# Altium project FPGA Accoustics.PrjPcb
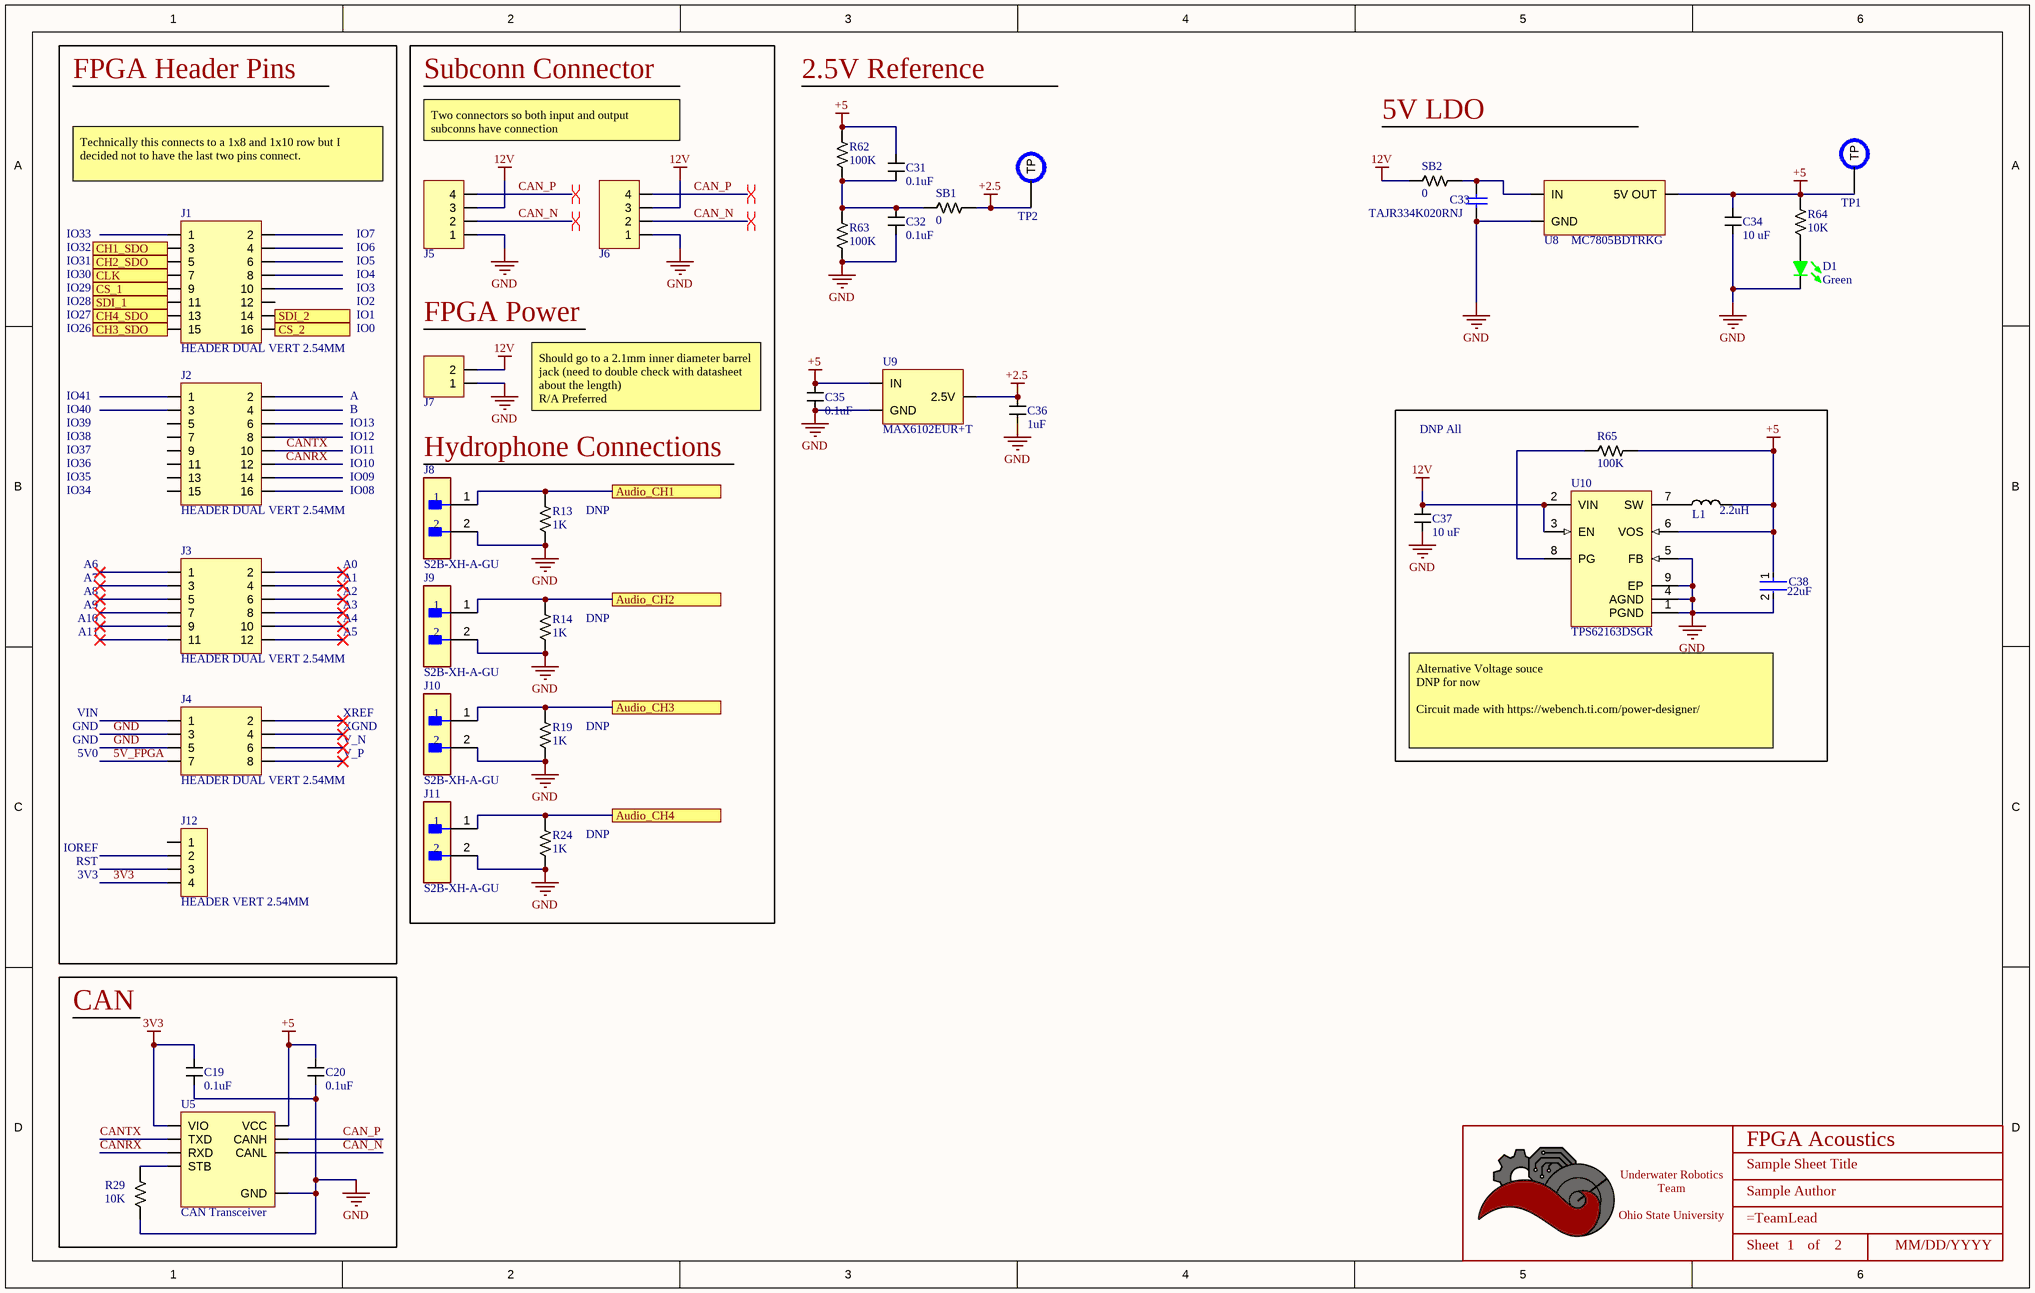
[diagram p0: Connectors.SchDoc]
ProjectTitle: FPGA Acoustics
2 sheets, 137 parts. Net scope: flat (ports and power ports of the same name join across sheets).
Board file: FPGA.PcbDoc
Sheets:
  Connectors.SchDoc
  Filters.SchDoc

## Sheet Connectors.SchDoc: Sample Sheet Title
size B; Date: MM/DD/YYYY; Author: Sample Author; Organization: ORGANIZATION; Address1: ADDRESS 1; Address2: ADDRESS 2; Address3: ADDRESS 3; Address4: ADDRESS 4; Revision: -; SheetNumber: 1; SheetTotal: 2; ENG_APP_DATE: --/--/--; DSN_APP_DATE: --/--/--; CHK_APP_DATE: --/--/--

### Parts
(Parts that share a designator on the sheet are numbered #1, #2 ... from top to bottom, then left to right.)
*#1  Title_Block  [LOGO]  (value not drawn)  (graphical)
C19  value 0.1uF  [CAPACITOR_0402]  (hidden comment: 100nF Ceramic 25V)
C20  value 0.1uF  [CAPACITOR_0402]  (hidden comment: 100nF Ceramic 25V)
C31  value 0.1uF  [CAPACITOR_0603]  (hidden comment: 100nF Ceramic 6.3V)
C32  value 0.1uF  [CAPACITOR_0603]  (hidden comment: 100nF Ceramic 6.3V)
C33  TAJR334K020RNJ  [CAPC2113X120X50NL20T30]
C34  Value (uF): 10 uF  [CAPACITOR_0603]  (hidden comment: 10uF Ceramic 6.3V)
C35  value 0.1uF  [CAPACITOR_0603]  (hidden comment: 100nF Ceramic 25V)
C36  value 1uF  [CAPACITOR_0603]  (hidden comment: 1uF Ceramic 16V)
C37  Value (uF): 10 uF  [CAPACITOR_1206]  (hidden comment: 10uF Ceramic 25V)
C38  Capacitance: 22uF  [FP-GRM31C-0_2-e0_3_0_8-MFG]  (hidden comment: GRM31CR71A226KE15L)
D1  Color: Green  [LED_0603]  (hidden comment: 150060GS75000)
J1  HEADER DUAL VERT 2.54MM  [HEADER_2x8PIN_2.54mm]
J2  HEADER DUAL VERT 2.54MM  [HEADER_2x8PIN_2.54mm]
J3  HEADER DUAL VERT 2.54MM  [HEADER_2x6PIN_2.54mm]
J4  HEADER DUAL VERT 2.54MM  [HEADER_2x4PIN_2.54mm]
J5  Microfit+ R/A  [CONN_MOLEX_MICROFIT+_4_POS_R/A - duplicate]  (value not drawn)
J6  Microfit+ R/A  [CONN_MOLEX_MICROFIT+_4_POS_R/A - duplicate]  (value not drawn)
J7  Microfit+ R/A  [CONN_MOLEX_MICROFIT+_2Flat_POS_R/A]  (value not drawn)
J8  S2B-XH-A-GU  [FP-S2B-XH-A-GU-MFG]
J9  S2B-XH-A-GU  [FP-S2B-XH-A-GU-MFG]
J10  S2B-XH-A-GU  [FP-S2B-XH-A-GU-MFG]
J11  S2B-XH-A-GU  [FP-S2B-XH-A-GU-MFG]
J12  HEADER VERT 2.54MM  [HEADER_4PIN_2.54MM]
L1  value 2.2uH  [PA4332.222NLT]  (hidden comment: 2.2uH Shielded)
R13  Value  (Ohms): 1K  [RESISTOR_0402]  (hidden comment: 1k Ohm 1% 1/16W)
R14  Value  (Ohms): 1K  [RESISTOR_0402]  (hidden comment: 1k Ohm 1% 1/16W)
R19  Value  (Ohms): 1K  [RESISTOR_0402]  (hidden comment: 1k Ohm 1% 1/16W)
R24  Value  (Ohms): 1K  [RESISTOR_0402]  (hidden comment: 1k Ohm 1% 1/16W)
R29  Value  (Ohms): 10K  [RESISTOR_0402]  (hidden comment: 10k Ohm 1% 1/16W)
R62  Value  (Ohms): 100K  [RESISTOR_0603]  (hidden comment: 100k Ohm 0.5% 1/10W)
R63  Value  (Ohms): 100K  [RESISTOR_0603]  (hidden comment: 100k Ohm 0.5% 1/10W)
R64  Value  (Ohms): 10K  [RESISTOR_0603]  (hidden comment: 10k Ohm 5% 1/10W)
R65  Value  (Ohms): 100K  [RESISTOR_0402]  (hidden comment: 100k Ohm 1% 1/16W)
SB1  Value  (Ohms): 0  [RESISTOR_0603]  (hidden comment: 0 Ohm Jumper No Fit)
SB2  value 0  [RESISTOR_1206]  (hidden comment: JUMPER_0_1206)
TP1  PCB Test Point  [TESTPOINT_1.2MM]  (value not drawn)  (no BOM)
TP2  PCB Test Point  [TESTPOINT_1.2MM]  (value not drawn)  (no BOM)
U5  CAN Transceiver  [SOIC-8]
U8  MC7805BDTRKG  [DPAK-2]
U9  MAX6102EUR+T  [SOT-23-3]
U10  TPS62163DSGR  [DSG0008A_V]

### Blocks framed on the sheet
FPGA Header Pins: J1-J4 J12
DNP All: C37 C38 L1 R65 U10
CAN: C19 C20 R29 U5

### Ports
Audio_CH1, Audio_CH2, Audio_CH3, Audio_CH4, CH1_SDO, CH2_SDO, CH3_SDO, CH4_SDO, CLK, CS_1, CS_2, SDI_1, SDI_2

### Nets
3V3: C19.1 J12.4 U5.5(VIO)
12V: C37.1 J5.3 J6.3 J7.2 SB2.2 U10.2(VIN) U10.3(EN)
+2.5: C36.1 SB1.1 TP2.TP U9.2(2.5V)
+5: C20.1 C31.1 C34.1 C35.1 C38.1 L1.1 R62.1 R64.1 R65.1 TP1.TP U5.3(VCC) U8.3(5V_OUT) U9.1(IN) U10.6(VOS)
GND: C19.2 C20.2 C32.2 C33.1 C34.2 C35.2 C36.2 C37.2 C38.2 D1.2 J4.3 J4.5 J5.1 J6.1 J7.1 J8.2 J9.2 J10.2 J11.2 R13.2 R14.2 R19.2 R24.2 R29.2 R63.2 U5.2(GND) U8.2(GND) U9.3(GND) U10.1(PGND) U10.4(AGND) U10.5(FB) U10.9(EP)
5V_FPGA: J4.7
Audio_CH1: J8.1 R13.1 ; port Audio_CH1
Audio_CH2: J9.1 R14.1 ; port Audio_CH2
Audio_CH3: J10.1 R19.1 ; port Audio_CH3
Audio_CH4: J11.1 R24.1 ; port Audio_CH4
CAN_N: J5.2 J6.2 U5.6(CANL)
CAN_P: J5.4 J6.4 U5.7(CANH)
CANRX: J2.12 U5.4(RXD)
CANTX: J2.10 U5.1(TXD)
CH1_SDO: J1.3 ; port CH1_SDO
CH2_SDO: J1.5 ; port CH2_SDO
CH3_SDO: J1.15 ; port CH3_SDO
CH4_SDO: J1.13 ; port CH4_SDO
CLK: J1.7 ; port CLK
CS_1: J1.9 ; port CS_1
CS_2: J1.16 ; port CS_2
SDI_1: J1.11 ; port SDI_1
SDI_2: J1.14 ; port SDI_2
NetC31_2: C31.2 C32.1 R62.2 R63.1 SB1.2
NetC33_2: C33.2 SB2.1 U8.1(IN)
NetD1_1: D1.1 R64.2
NetL1_2: L1.2 U10.7(SW)
NetR29_1: R29.1 U5.8(STB)
NetR65_2: R65.2 U10.8(PG)

Not connected (* = marked no-connect by the designer): J1 1 2 4 6 8 10 12; J2 1 2 3 4 5 6 7 8 9 11 13 14 15 16; J3 1* 2* 3* 4* 5* 6* 7* 8* 9* 10* 11* 12*; J4 1 2* 4* 6* 8*; J12 1 2 3

### Layout directives
differential pair: CAN_N, CAN_P

### Notes on the sheet
- Subconn Connector
- 2.5V Reference
- Two connectors so both input and output subconns have connection
- 5V LDO
- IO33
- Technically this connects to a 1x8 and 1x10 row but I decided not to have the last two pins connect.
- IO7
- IO29
- IO30
- IO31
- IO32
- IO6
- IO5
- IO4
- IO3
- IO26
- IO27
- IO28
- IO2
- IO1
- IO0
- FPGA Power
- IO41
- IO40
- IO39
- A
- B
- IO13
- Should go to a 2.1mm inner diameter barrel jack (need to double check with datasheet about the length)
  R/A Preferred
- IO38
- IO37
- IO36
- IO35
- IO34
- IO12
- IO11
- IO10
- IO09
- IO08
- Hydrophone Connections
- A6
- A0
- (near R13) DNP
- A7
- A8
- A9
- A10
- A11
- A1
- A2
- A3
- A4
- A5
- (near R14) DNP
- VIN
- GND
- 5V0
- XREF
- XGND
- V_N
- V_P
- (near R19) DNP
- Alternative Voltage souce
  DNP for now
  Circuit made with https://webench.ti.com/power-designer/
- (near R24) DNP
- IOREF
- RST
- 3V3
- DWG. NO.
- REV.
- SHT.
- THIS DOCUMENT AND THE DATA DISCLOSED HEREIN OR HEREWITH IS THE PROPERTY OF ALTIUM LIMITED AND MAY BE FREELY DISTRIBUTED IN WHOLE. NO RIGHTS ARE RESERVED OR EXPRESS OR IMPLIED WARANTEE GIVEN.
- REVISION
- DESCRIPTION
- DATE
- APPROVED
- ENG:
- APPROVALS
- PROJECT
- DSN:
- CHK:
- REFERENCE DOCUMENTS
- PROJECT REVISION:
- TITLE
- DOCUMENT REVISION:
- DESIGN ITEM:
- BOM:
- FAB DWG:
- PCB DWG:
- ASSY DWG:
- SCALE:
- SIZE
- CAGE CODE
- FILE NAME
- DWG NO.
- SHEET
- OF
- REV
- (in symbol Title_Block) Underwater Robotics Team / Ohio State University; Sheet; of

### Library data of the parts
*#1 = Title_Block: UWRT Schematic Title Block Template / Created June 2021, Dylan Trainor
C19 C20 = CAPACITOR_0.1uF_0402: Cap 100nF 25V +/-10% / Ceramic 0402; Made By: Robert Pafford; Tolerance: +/- 10%; Voltage: 25V; Supplier 1: Digi-Key; Supplier Part Number 1: 478-7868-1-ND
C31 C32 = CAPACITOR_0.1uF_0603: Cap 100nF 6.3V +/-10% / Ceramic 0603; Made By: Flip B; ComponentLink1Description: Datsheet; ComponentLink1URL: https://www.mouser.com/datasheet/2/212/KEM_C1002_X7R_SMD-1102033.pdf; Tolerance: +/- 10%; Voltage: 6.3V; Supplier 1: Digi-Key; Supplier Part Number 1: 399-15351-1-ND
C33 = CMP-2007-04068-1: Manufacturer: AVX Interconnect / Elco; Part Number: TAJR334K020RNJ
C34 = CAPACITOR_10uF_0603: Cap 10uF 6.3V +/-20% / Ceramic 0603; Made By: Flip B; ComponentLink1Description: Digikey; ComponentLink1URL: https://www.digikey.com/en/products/detail/samsung-electro-mechanics/CL10A106MQ8NNNC/3886777; Supplier 1: Digi-Key; Supplier Part Number 1: 1276-1119-1-ND; Tolerance: +/- 20%; Voltage: 6.3V
C35 = CAPACITOR_0.1uF_0603_25V: Cap 100nF 25V +/-10% / Ceramic 0603; Voltage: 6.3V; Made By: Flip B; ComponentLink1Description: Datsheet; ComponentLink1URL: https://www.mouser.com/datasheet/2/212/KEM_C1002_X7R_SMD-1102033.pdf; Tolerance: +/- 10%; Supplier 1: Digikey; Supplier Part Number 1: 1276-1006-1-ND
C36 = CAPACITOR_1uF_0603: Cap 1uF 16V +/-10% / Ceramic 0603; Made By: Flip B; Tolerance: +/- 10%; Voltage: 16V; Supplier 1: Arrow Electronics; Supplier Part Number 1: C1608X7R1C105K080AC
C37 = CAPACITOR_10uF_1206: Cap 10uF 25V +/-10% / Ceramic 1206; Made By: Robert Pafford; Tolerance: +/- 10%; Voltage: 25V; Supplier 1: Digi-Key; Supplier Part Number 1: 1276-1804-6-ND
C38 = CMP-06035-003841-1: Chip Multilayer Ceramic Capacitors for General Purpose, 1206, 22uF, X7R, 15%, 10%, 10V; Height: 1.6mm; Width: 0.063inch; Min Operating Temperature: -55°C; Package Quantity: 1; Termination: SMD/SMT; Length: 3.2mm; Voltage Rating: 10V; Case/Package: 1206; Case Code (Imperial): 1206; Depth: 1.6mm; Dielectric: X7R; Voltage: 10V; Material: Ceramic; Tolerance: 10%; Voltage Rating (DC): 10V; Lead Free: Lead Free; Max Operating Temperature: 125°C; Case Code (Metric): 3216; Packaging: Tape and Reel; Thickness: 0.071inch; Radiation Hardening: No; REACH SVHC: No SVHC; Mount: Surface Mount
D1 = LED_Green_0603_3.2V: LED Green Vf= 3.2V If = 0.025A / 150060GS75000; Made By: Flip B; Forward Current: 25mA; Supplier 1: Digi-Key; ComponentLink1Description: Datasheet; ComponentLink1URL: https://www.we-online.de/katalog/datasheet/150060GS75000.pdf; Supplier Part Number 1: 732-4971-1-ND; Forward Voltage: 3.2V; Package: 0603
J1 J2 = HEADER_2x8PIN_2.54_1: CONN HEADER VERT 8POS 2.54MM; Pitch (mm): 2.54; Positions: 16; Created By: John Ulm; Supplier 1: DigiKey; Supplier Part Number 1: WM8144-ND
J3 = HEADER_2x6PIN_2.54: CONN HEADER VERT 6POS 2.54MM; Pitch (mm): 2.54; Positions: 12; Created By: John Ulm; Supplier 1: DigiKey; Supplier Part Number 1: 2057-PH2-12-UA-ND
J4 = HEADER_2x4PIN_2.54_1: CONN HEADER VERT 4POS 2.54MM; Pitch (mm): 2.54; Positions: 8; Created By: John Ulm; Supplier 1: RS (Formerly Allied Electronics); Supplier Part Number 1: PH2-08-UA
J5 J6 = CONN_MOLEX_MICROFIT+_4POS_R/A: Molex Microfit+ / 212528 4 POS R/A Black; Pitch: 3.0mm; Current Per Pin: 12.5A; Manufacturer: Molex; Supplier 1: Digikey; Supplier Part Number 1: 900-2125280400-ND; Configuration: R/A; Color: Black
J7 = CONN_MOLEX_MICROFIT+_2POS_Flat_R/A: Molex Microfit+ / 2157601002 2POS Right Angle; Pitch: 3.0mm; Current Per Pin: 12.5A; Manufacturer: Molex; Configuration: R/A; Color: Black; Supplier 1: DigiKey; Supplier Part Number 1: 900-2157601002-ND
J8-J11 = CMP-17439-000226-1: Conn Shrouded Header HDR 2 POS 2.45mm Solder ST Top Entry Thru-Hole; Lead Free: Lead Free
J12 = HEADER_4PIN_2.54MM: CONN HEADER VERT 4POS 2.54MM; Made By: Robert Pafford; Supplier 1: Digi-Key; Supplier Part Number 1: S1012E-04-ND
L1 = INDUCTOR_2.2uH: 2.2 µH Shielded Drum Core, Wirewound Inductor 4.3 A 48mOhm Max Nonstandard; Supplier 1: DigiKey; Supplier Part Number 1: 553-3290-1-ND
R13 R14 R19 R24 = RESISTOR_1K_0402: RES 1k OHM 1% 1/16W 0402; Tolerance: +/- 1%; Made By: Robert Pafford; Wattage: 1/16W; Supplier: Digikey; Digikey Part Numer: CR0603-JW-104ELFTR-ND; Supplier 1: Digi-Key; Supplier Part Number 1: 13-AC0402FR-131KLCT-ND
R29 = RESISTOR_10K_0402: RES 10k OHM 1% 1/16W 0402; Tolerance: +/- 1%; Made By: Robert Pafford; Wattage: 1/16W; Supplier: Digikey; Digikey Part Numer: CR0603-JW-104ELFTR-ND; Supplier 1: Digi-Key; Supplier Part Number 1: YAG3436CT-ND
R62 R63 = RESISTOR_100K_0.5%_0603: RES 100k OHM 0.5% 1/10W 0603; Tolerance: +/- 0.5%; Made By: John Ulm; ComponentLink1Description: Datasheet; ComponentLink1URL: https://www.bourns.com/docs/product-datasheets/CRxxxxx.pdf; Wattage: 1/10W; Supplier: Digikey; Digikey Part Numer: CR0603-JW-104ELFTR-ND; Supplier 1: Digi-Key; Supplier Part Number 1: 311-2395-1-ND
R64 = RESISTOR_10K_0603: RES 10k OHM 5% 1/10W 0603; Tolerance: +/- 5%; Wattage: 1/8W; Made By: Robert Pafford; ComponentLink1Description: Datasheet; ComponentLink1URL: https://www.bourns.com/docs/product-datasheets/CRxxxxx.pdf; Supplier: Digikey; Digikey Part Numer: CR0603-JW-104ELFTR-ND; Supplier 1: Digi-Key; Supplier Part Number 1: 2019-RK73B1JTTD103JCT-ND
R65 = RESISTOR_100K_0402: RES 100k OHM 1% 1/16W 0402; Tolerance: +/- 1%; Made By: Robert Pafford; Wattage: 1/16W; Supplier 1: Digikey; Supplier Part Number 1: YAG3434CT-ND
SB1 = JUMPER_0_0603: 0 Ohm Jumper No Fit for Solder Bridge; Made By: Robert Pafford; ComponentLink1Description: Digikey; ComponentLink1URL: https://www.digikey.com/en/products/detail/koa-speer-electronics-inc/RK73B1JTTD101J/9844701
SB2 = JUMPER_0_1206: JUMPER 0OHM 1206
TP1 TP2 = TESTPOINT: Made By: Robert Pafford
U5 = TJA1442AT: CAN Interface IC High-Speed CAN Transceiver with Standby Mode; Made By: Robert Pafford; Max Data Rate: 5Mbps; Supplier 1: Mouser; Supplier Part Number 1: 771-TJA1442AT/0Z
U8 = MC7805BDTRKG: Linear Voltage Regulator IC Positive Fixed 1 Output 1A DPAK
U9 = MAX6102EUR+T: Series Voltage Reference IC Fixed 2.5V V ±0.4% 5 mA SOT-23-3; Supplier 1: DigiKey; Supplier Part Number 1: MAX6102EUR+TCT-ND
U10 = CMP-0323-00318-3: Buck Step Down Regulator with 3 to 17 V Input and 5 V Output, -40 to 85 degC, 8-Pin WSON (DSG), Green (RoHS & no Sb/Br); Manufacturer: Texas Instruments; Synchronous Rectification: TRUE; Vout(Max)(V): 5; Iq(Typ)(mA): 0.017; Rating: Catalog; Switch Current Limit(Typ)(A): 1.8; Iout(Max)(A): 1; Vin(Max)(V): 17; Duty Cycle(Max)(%): 100; Vin(Min)(V): 3; SubFamily: Step-Down Regulator; PartNumber: TPS62163DSGR; PackageDescription: 8-Pin Plastic Small Outline No-Lead, 2 x 2 x 0.8 mm Body, 0.5 mm Pitch, Exposed Pad; PackageReference: DSG0008A; ComponentLink2Description: Package Specification; PackageVersion: revB, Oct-2010; ComponentLink1URL: http://www.ti.com/general/docs/lit/getliterature.tsp?genericPartNumber=TPS62163&fileType=pdf; ComponentLink2URL: http://www.ti.com/litv/pdf/mpds308a; DatasheetVersion: SLVSAM2A; Mounting Technology: Surface Mount; Eco-Plan: Green (RoHS & no Sb/Br); Code_JEDEC: MO-229; ComponentLink3Description: URL Link1; Topology: Buck; Regulated Outputs(#): 1; Preset Vout(V): 5; Vout(Min)(V): 5; ComponentLink1Description: Datasheet; ComponentLink3URL: Samples URL:http://www.ti.com/product/tps62163#samples

## Sheet Filters.SchDoc: Sample Sheet Title
size B; Date: MM/DD/YYYY; Author: Sample Author; Organization: ORGANIZATION; Address1: ADDRESS 1; Address2: ADDRESS 2; Address3: ADDRESS 3; Address4: ADDRESS 4; Revision: -; SheetNumber: 2; SheetTotal: 2; ENG_APP_DATE: --/--/--; DSN_APP_DATE: --/--/--; CHK_APP_DATE: --/--/--
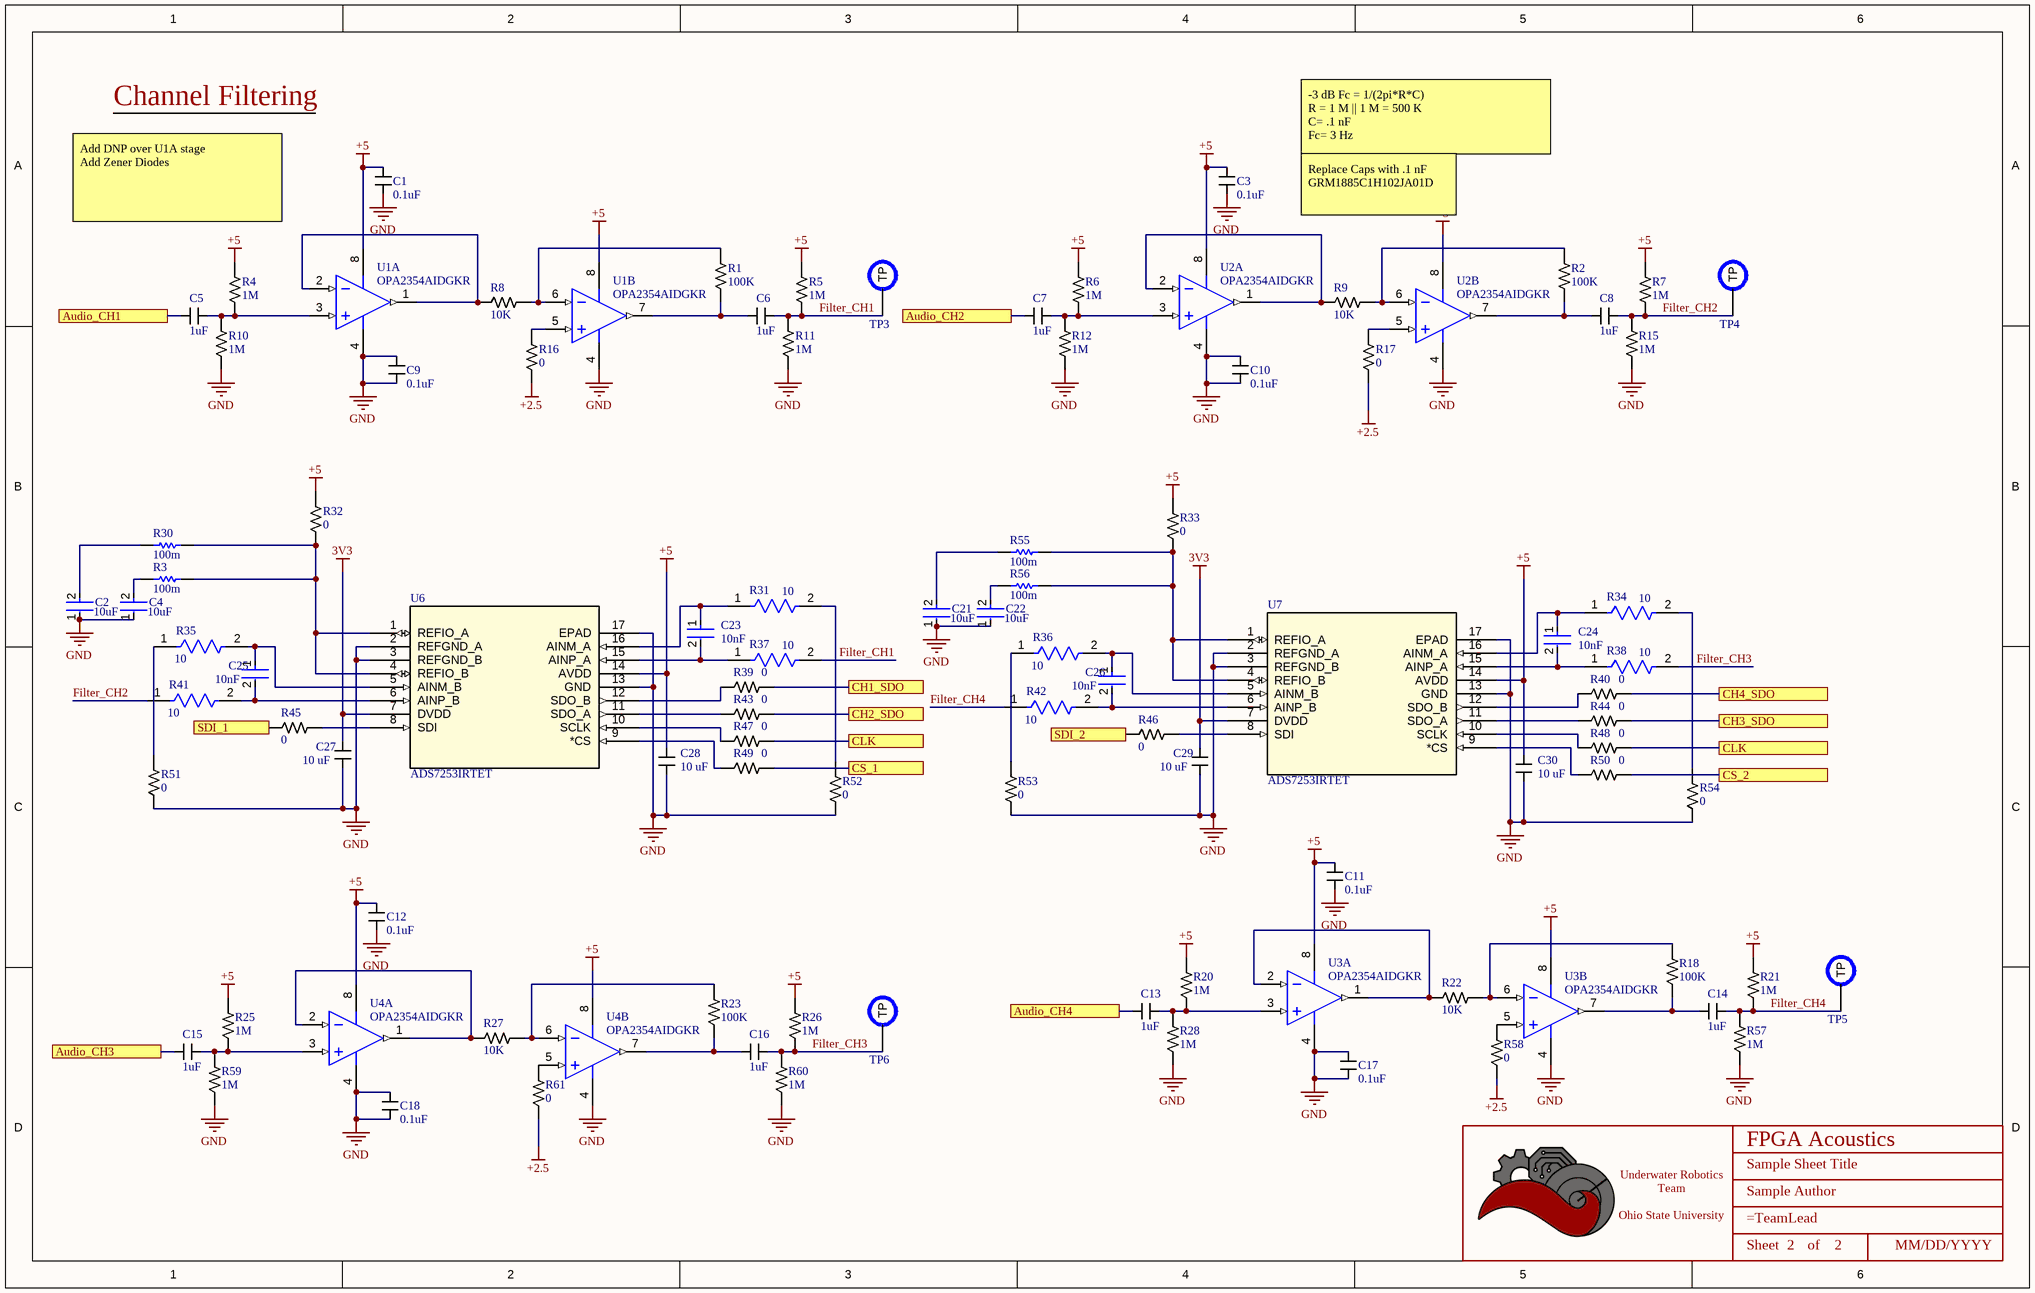
[diagram p1: Filters.SchDoc]

### Parts
(Parts that share a designator on the sheet are numbered #1, #2 ... from top to bottom, then left to right.)
*#2  Title_Block  [LOGO]  (value not drawn)  (graphical)
C1  value 0.1uF  [CAPACITOR_0603]  (hidden comment: 100nF Ceramic 25V)
C2  value 10uF  [FP-CL21B106KOQNNNE-MFG]  (hidden comment: CL21B106KOQNNNE)
C3  value 0.1uF  [CAPACITOR_0603]  (hidden comment: 100nF Ceramic 25V)
C4  value 10uF  [FP-CL21B106KOQNNNE-MFG]  (hidden comment: CL21B106KOQNNNE)
C5  value 1uF  [CAPACITOR_0603]  (hidden comment: 1uF Ceramic 16V)
C6  value 1uF  [CAPACITOR_0603]  (hidden comment: 1uF Ceramic 16V)
C7  value 1uF  [CAPACITOR_0603]  (hidden comment: 1uF Ceramic 16V)
C8  value 1uF  [CAPACITOR_0603]  (hidden comment: 1uF Ceramic 16V)
C9  value 0.1uF  [CAPACITOR_0603]  (hidden comment: 100nF Ceramic 25V)
C10  value 0.1uF  [CAPACITOR_0603]  (hidden comment: 100nF Ceramic 25V)
C11  value 0.1uF  [CAPACITOR_0603]  (hidden comment: 100nF Ceramic 25V)
C12  value 0.1uF  [CAPACITOR_0603]  (hidden comment: 100nF Ceramic 25V)
C13  value 1uF  [CAPACITOR_0603]  (hidden comment: 1uF Ceramic 16V)
C14  value 1uF  [CAPACITOR_0603]  (hidden comment: 1uF Ceramic 16V)
C15  value 1uF  [CAPACITOR_0603]  (hidden comment: 1uF Ceramic 16V)
C16  value 1uF  [CAPACITOR_0603]  (hidden comment: 1uF Ceramic 16V)
C17  value 0.1uF  [CAPACITOR_0603]  (hidden comment: 100nF Ceramic 25V)
C18  value 0.1uF  [CAPACITOR_0603]  (hidden comment: 100nF Ceramic 25V)
C21  value 10uF  [FP-CL21B106KOQNNNE-MFG]  (hidden comment: CL21B106KOQNNNE)
C22  value 10uF  [FP-CL21B106KOQNNNE-MFG]  (hidden comment: CL21B106KOQNNNE)
C23  Capacitance: 10nF  [FP-GRM219-0_1-IPC_B]  (hidden comment: GRM2195C1H103JA01D)
C24  Capacitance: 10nF  [FP-GRM219-0_1-IPC_B]  (hidden comment: GRM2195C1H103JA01D)
C25  Capacitance: 10nF  [FP-GRM219-0_1-IPC_B]  (hidden comment: GRM2195C1H103JA01D)
C26  Capacitance: 10nF  [FP-GRM219-0_1-IPC_B]  (hidden comment: GRM2195C1H103JA01D)
C27  Value (uF): 10 uF  [CAPACITOR_0603]  (hidden comment: 10uF Ceramic 6.3V)
C28  Value (uF): 10 uF  [CAPACITOR_0603]  (hidden comment: 10uF Ceramic 6.3V)
C29  Value (uF): 10 uF  [CAPACITOR_0603]  (hidden comment: 10uF Ceramic 6.3V)
C30  Value (uF): 10 uF  [CAPACITOR_0603]  (hidden comment: 10uF Ceramic 6.3V)
R1  Value  (Ohms): 100K  [RESISTOR_0402]  (hidden comment: 100k Ohm 1% 1/16W)
R2  Value  (Ohms): 100K  [RESISTOR_0402]  (hidden comment: 100k Ohm 1% 1/16W)
R3  100m  [RESC1005X40X25NL10T10]
R4  Value  (Ohms): 1M  [RESISTOR_0402]  (hidden comment: 1M Ohm 1% 1/16W)
R5  Value  (Ohms): 1M  [RESISTOR_0402]  (hidden comment: 1M Ohm 1% 1/16W)
R6  Value  (Ohms): 1M  [RESISTOR_0402]  (hidden comment: 1M Ohm 1% 1/16W)
R7  Value  (Ohms): 1M  [RESISTOR_0402]  (hidden comment: 1M Ohm 1% 1/16W)
R8  Value  (Ohms): 10K  [RESISTOR_0402]  (hidden comment: 10k Ohm 1% 1/16W)
R9  Value  (Ohms): 10K  [RESISTOR_0402]  (hidden comment: 10k Ohm 1% 1/16W)
R10  Value  (Ohms): 1M  [RESISTOR_0402]  (hidden comment: 1M Ohm 1% 1/16W)
R11  Value  (Ohms): 1M  [RESISTOR_0402]  (hidden comment: 1M Ohm 1% 1/16W)
R12  Value  (Ohms): 1M  [RESISTOR_0402]  (hidden comment: 1M Ohm 1% 1/16W)
R15  Value  (Ohms): 1M  [RESISTOR_0402]  (hidden comment: 1M Ohm 1% 1/16W)
R16  Value  (Ohms): 0  [RESISTOR_0402]  (hidden comment: 0 Ohm 1% 1/16W)
R17  Value  (Ohms): 0  [RESISTOR_0402]  (hidden comment: 0 Ohm 1% 1/16W)
R18  Value  (Ohms): 100K  [RESISTOR_0402]  (hidden comment: 100k Ohm 1% 1/16W)
R20  Value  (Ohms): 1M  [RESISTOR_0402]  (hidden comment: 1M Ohm 1% 1/16W)
R21  Value  (Ohms): 1M  [RESISTOR_0402]  (hidden comment: 1M Ohm 1% 1/16W)
R22  Value  (Ohms): 10K  [RESISTOR_0402]  (hidden comment: 10k Ohm 1% 1/16W)
R23  Value  (Ohms): 100K  [RESISTOR_0402]  (hidden comment: 100k Ohm 1% 1/16W)
R25  Value  (Ohms): 1M  [RESISTOR_0402]  (hidden comment: 1M Ohm 1% 1/16W)
R26  Value  (Ohms): 1M  [RESISTOR_0402]  (hidden comment: 1M Ohm 1% 1/16W)
R27  Value  (Ohms): 10K  [RESISTOR_0402]  (hidden comment: 10k Ohm 1% 1/16W)
R28  Value  (Ohms): 1M  [RESISTOR_0402]  (hidden comment: 1M Ohm 1% 1/16W)
R30  100m  [RESC1005X40X25NL10T10]
R31  Resistance: 10  [FP-RMCF0603-MFG]  (hidden comment: RMCF0603FT10R0)
R32  Value  (Ohms): 0  [RESISTOR_0402]  (hidden comment: 0 Ohm 1% 1/16W)
R33  Value  (Ohms): 0  [RESISTOR_0402]  (hidden comment: 0 Ohm 1% 1/16W)
R34  Resistance: 10  [FP-RMCF0603-MFG]  (hidden comment: RMCF0603FT10R0)
R35  Resistance: 10  [FP-RMCF0603-MFG]  (hidden comment: RMCF0603FT10R0)
R36  Resistance: 10  [FP-RMCF0603-MFG]  (hidden comment: RMCF0603FT10R0)
R37  Resistance: 10  [FP-RMCF0603-MFG]  (hidden comment: RMCF0603FT10R0)
R38  Resistance: 10  [FP-RMCF0603-MFG]  (hidden comment: RMCF0603FT10R0)
R39  Value  (Ohms): 0  [RESISTOR_0402]  (hidden comment: 0 Ohm 1% 1/16W)
R40  Value  (Ohms): 0  [RESISTOR_0402]  (hidden comment: 0 Ohm 1% 1/16W)
R41  Resistance: 10  [FP-RMCF0603-MFG]  (hidden comment: RMCF0603FT10R0)
R42  Resistance: 10  [FP-RMCF0603-MFG]  (hidden comment: RMCF0603FT10R0)
R43  Value  (Ohms): 0  [RESISTOR_0402]  (hidden comment: 0 Ohm 1% 1/16W)
R44  Value  (Ohms): 0  [RESISTOR_0402]  (hidden comment: 0 Ohm 1% 1/16W)
R45  Value  (Ohms): 0  [RESISTOR_0402]  (hidden comment: 0 Ohm 1% 1/16W)
R46  Value  (Ohms): 0  [RESISTOR_0402]  (hidden comment: 0 Ohm 1% 1/16W)
R47  Value  (Ohms): 0  [RESISTOR_0402]  (hidden comment: 0 Ohm 1% 1/16W)
R48  Value  (Ohms): 0  [RESISTOR_0402]  (hidden comment: 0 Ohm 1% 1/16W)
R49  Value  (Ohms): 0  [RESISTOR_0402]  (hidden comment: 0 Ohm 1% 1/16W)
R50  Value  (Ohms): 0  [RESISTOR_0402]  (hidden comment: 0 Ohm 1% 1/16W)
R51  Value  (Ohms): 0  [RESISTOR_0402]  (hidden comment: 0 Ohm 1% 1/16W)
R52  Value  (Ohms): 0  [RESISTOR_0402]  (hidden comment: 0 Ohm 1% 1/16W)
R53  Value  (Ohms): 0  [RESISTOR_0402]  (hidden comment: 0 Ohm 1% 1/16W)
R54  Value  (Ohms): 0  [RESISTOR_0402]  (hidden comment: 0 Ohm 1% 1/16W)
R55  100m  [RESC1005X40X25NL10T10]
R56  100m  [RESC1005X40X25NL10T10]
R57  Value  (Ohms): 1M  [RESISTOR_0402]  (hidden comment: 1M Ohm 1% 1/16W)
R58  Value  (Ohms): 0  [RESISTOR_0402]  (hidden comment: 0 Ohm 1% 1/16W)
R59  Value  (Ohms): 1M  [RESISTOR_0402]  (hidden comment: 1M Ohm 1% 1/16W)
R60  Value  (Ohms): 1M  [RESISTOR_0402]  (hidden comment: 1M Ohm 1% 1/16W)
R61  Value  (Ohms): 0  [RESISTOR_0402]  (hidden comment: 0 Ohm 1% 1/16W)
TP3  PCB Test Point  [TESTPOINT_1.2MM]  (value not drawn)  (no BOM)
TP4  PCB Test Point  [TESTPOINT_1.2MM]  (value not drawn)  (no BOM)
TP5  PCB Test Point  [TESTPOINT_1.2MM]  (value not drawn)  (no BOM)
TP6  PCB Test Point  [TESTPOINT_1.2MM]  (value not drawn)  (no BOM)
U1  OPA2354AIDGKR  [DGK0008A_M]  (parts A,B of 2)
U2  OPA2354AIDGKR  [DGK0008A_M]  (parts A,B of 2)
U3  OPA2354AIDGKR  [DGK0008A_M]  (parts A,B of 2)
U4  OPA2354AIDGKR  [DGK0008A_M]  (parts A,B of 2)
U6  ADS7253IRTET  [WQFN-16]
U7  ADS7253IRTET  [WQFN-16]

### Ports
Audio_CH1, Audio_CH2, Audio_CH3, Audio_CH4, CH1_SDO, CH2_SDO, CH3_SDO, CH4_SDO, CLK, CS_1, CS_2, SDI_1, SDI_2

### Nets
3V3: C27.2 C29.2 U6.7(DVDD) U7.7(DVDD)
+2.5: R16.2 R17.2 R58.2 R61.2
+5: C1.1 C3.1 C11.1 C12.1 C28.2 C30.2 R4.1 R5.1 R6.1 R7.1 R20.1 R21.1 R25.1 R26.1 R32.1 R33.1 U1.8(V+) U2.8(V+) U3.8(V+) U4.8(V+) U6.14(AVDD) U7.14(AVDD)
GND: C1.2 C2.1 C3.2 C4.1 C9.1 C9.2 C10.1 C10.2 C11.2 C12.2 C17.1 C17.2 C18.1 C18.2 C21.1 C22.1 C27.1 C28.1 C29.1 C30.1 R10.2 R11.2 R12.2 R15.2 R28.2 R51.2 R52.2 R53.2 R54.2 R57.2 R59.2 R60.2 U1.4(V-) U2.4(V-) U3.4(V-) U4.4(V-) U6.2(REFGND_A) U6.3(REFGND_B) U6.13(GND) U6.17(EPAD) U7.2(REFGND_A) U7.3(REFGND_B) U7.13(GND) U7.17(EPAD)
Audio_CH1: C5.2 ; port Audio_CH1
Audio_CH2: C7.2 ; port Audio_CH2
Audio_CH3: C15.2 ; port Audio_CH3
Audio_CH4: C13.2 ; port Audio_CH4
CH1_SDO: R39.1 ; port CH1_SDO
CH2_SDO: R43.1 ; port CH2_SDO
CH3_SDO: R44.1 ; port CH3_SDO
CH4_SDO: R40.1 ; port CH4_SDO
CLK: R47.1 R48.1 ; port CLK
CS_1: R49.1 ; port CS_1
CS_2: R50.1 ; port CS_2
Filter_CH1: C6.1 R5.2 R11.1 R37.2 TP3.TP
Filter_CH2: C8.1 R7.2 R15.1 R41.1 TP4.TP
Filter_CH3: C16.1 R26.2 R38.2 R60.1 TP6.TP
Filter_CH4: C14.1 R21.2 R42.1 R57.1 TP5.TP
SDI_1: R45.2 ; port SDI_1
SDI_2: R46.2 ; port SDI_2
NetC2_2: C2.2 R30.2
NetC4_2: C4.2 R3.2
NetC5_1: C5.1 R4.2 R10.1 U1.3(IN_A+)
NetC6_2: C6.2 R1.2 U1.7(OUT_B)
NetC7_1: C7.1 R6.2 R12.1 U2.3(IN_A+)
NetC8_2: C8.2 R2.2 U2.7(OUT_B)
NetC13_1: C13.1 R20.2 R28.1 U3.3(IN_A+)
NetC14_2: C14.2 R18.2 U3.7(OUT_B)
NetC15_1: C15.1 R25.2 R59.1 U4.3(IN_A+)
NetC16_2: C16.2 R23.2 U4.7(OUT_B)
NetC21_2: C21.2 R55.2
NetC22_2: C22.2 R56.2
NetC23_1: C23.1 R31.1 U6.16(AINM_A)
NetC23_2: C23.2 R37.1 U6.15(AINP_A)
NetC24_1: C24.1 R34.1 U7.16(AINM_A)
NetC24_2: C24.2 R38.1 U7.15(AINP_A)
NetC25_1: C25.1 R35.2 U6.5(AINM_B)
NetC25_2: C25.2 R41.2 U6.6(AINP_B)
NetC26_1: C26.1 R36.2 U7.5(AINM_B)
NetC26_2: C26.2 R42.2 U7.6(AINP_B)
NetR1_1: R1.1 R8.1 U1.6(IN_B-)
NetR2_1: R2.1 R9.1 U2.6(IN_B-)
NetR3_1: R3.1 R30.1 R32.2 U6.1(REFIO_A) U6.4(REFIO_B)
NetR8_2: R8.2 U1.1(OUT_A) U1.2(IN_A-)
NetR9_2: R9.2 U2.1(OUT_A) U2.2(IN_A-)
NetR16_1: R16.1 U1.5(IN_B+)
NetR17_1: R17.1 U2.5(IN_B+)
NetR18_1: R18.1 R22.1 U3.6(IN_B-)
NetR22_2: R22.2 U3.1(OUT_A) U3.2(IN_A-)
NetR23_1: R23.1 R27.1 U4.6(IN_B-)
NetR27_2: R27.2 U4.1(OUT_A) U4.2(IN_A-)
NetR31_2: R31.2 R52.1
NetR33_2: R33.2 R55.1 R56.1 U7.1(REFIO_A) U7.4(REFIO_B)
NetR34_2: R34.2 R54.1
NetR35_1: R35.1 R51.1
NetR36_1: R36.1 R53.1
NetR39_2: R39.2 U6.12(SDO_B)
NetR40_2: R40.2 U7.12(SDO_B)
NetR43_2: R43.2 U6.11(SDO_A)
NetR44_2: R44.2 U7.11(SDO_A)
NetR45_1: R45.1 U6.8(SDI)
NetR46_1: R46.1 U7.8(SDI)
NetR47_2: R47.2 U6.10(SCLK)
NetR48_2: R48.2 U7.10(SCLK)
NetR49_2: R49.2 U6.9(*CS)
NetR50_2: R50.2 U7.9(*CS)
NetR58_1: R58.1 U3.5(IN_B+)
NetR61_1: R61.1 U4.5(IN_B+)

### Notes on the sheet
- Channel Filtering
- -3 dB Fc = 1/(2pi*R*C)
  R = 1 M || 1 M = 500 K
  C= .1 nF
  Fc= 3 Hz
- Add DNP over U1A stage
  Add Zener Diodes
- Replace Caps with .1 nF
  GRM1885C1H102JA01D
- DWG. NO.
- REV.
- SHT.
- THIS DOCUMENT AND THE DATA DISCLOSED HEREIN OR HEREWITH IS THE PROPERTY OF ALTIUM LIMITED AND MAY BE FREELY DISTRIBUTED IN WHOLE. NO RIGHTS ARE RESERVED OR EXPRESS OR IMPLIED WARANTEE GIVEN.
- REVISION
- DESCRIPTION
- DATE
- APPROVED
- ENG:
- APPROVALS
- PROJECT
- DSN:
- CHK:
- REFERENCE DOCUMENTS
- PROJECT REVISION:
- TITLE
- DOCUMENT REVISION:
- DESIGN ITEM:
- BOM:
- FAB DWG:
- PCB DWG:
- ASSY DWG:
- SCALE:
- SIZE
- B
- CAGE CODE
- FILE NAME
- DWG NO.
- SHEET
- OF
- REV
- (in symbol Title_Block) Underwater Robotics Team / Ohio State University; Sheet; of

### Library data of the parts
*#2 = Title_Block: as *#1 on sheet Connectors
C1 C3 C9-C12 C17 C18 = CAPACITOR_0.1uF_0603_25V: as C35 on sheet Connectors; ComponentLink1Description: Datsheet; ComponentLink1URL: https://www.mouser.com/datasheet/2/212/KEM_C1002_X7R_SMD-1102033.pdf; Tolerance: +/- 10%; Supplier 1: Digikey; Supplier Part Number 1: 1276-1006-1-ND
C2 C4 C21 C22 = CMP-2000-06106-2: CAP CER 10UF 16V X7R 0805; Manufacturer: Samsung Electro-Mechanics America, Inc; Material: Ceramic; Tolerance: 10%; Temperature Coefficient: 15%; Digikey Description: CAP CER 10UF 16V X7R 0805; Lead Free: Yes; ComponentLink2URL: http://www.samsungsem.com/servlet/FileDownload?path=productsearch&sname=CL21B106KOQNNNE.pdf&oname=CL21B106KOQNNNE.pdf; ComponentLink2Description: Datasheet; Temperature Range Low: -55°C; RoHS: TRUE; Category: Cap; Temperature Characteristic: X7R; Manufacturer Part Number: CL21B106KOQNNNE; Automotive: No; Octopart: https://octopart.com/cl21b106koqnnne-samsung-19832289; Device Class L3: Ceramic Capacitors; Temperature Range High: +125°C; Height: 1.4mm; Device Class L2: Capacitors; Voltage Rating: 16V; Temperature: -55°C to +125°C; Device Class L1: Passive Components; Ipc Land Pattern Name: CAPC200125X125; Package: CL21B106KOQNNNE; Capacitance: 10uF
C5-C8 C13-C16 = CAPACITOR_1uF_0603: as C36 on sheet Connectors; Tolerance: +/- 10%; Voltage: 16V; Supplier 1: Arrow Electronics; Supplier Part Number 1: C1608X7R1C105K080AC
C23-C26 = CMP-2007-00135-2: Chip Multilayer Ceramic Capacitors for General Purpose, 0805, 10000pF, C0G, 30ppm/°C, 5%, 50V; Insulation Resistance: 10GR; Max Operating Temperature: 125°C; Height: 0.85mm; Voltage: 50V; Dielectric Material: Ceramic; Voltage Rating: 50V; Dielectric: C0G; Thickness: 0.037inch; REACH SVHC: No SVHC; Lead Free: Lead Free; Depth: 1.25mm; Min Operating Temperature: -55°C; Package Quantity: 1; Packaging: Tape and Reel; Case Code (Imperial): 0805; Case/Package: 0805; Mount: Surface Mount; Width: 0.049inch; Case Code (Metric): 2012; Length: 2mm; Termination: SMD/SMT; Material: Ceramic; Tolerance: 5%; Temperature Coefficient: 30ppm/°C; Number of Pins: 2; Voltage Rating (DC): 50V; Radiation Hardening: No
C27-C30 = CAPACITOR_10uF_0603: as C34 on sheet Connectors; ComponentLink1Description: Digikey; ComponentLink1URL: https://www.digikey.com/en/products/detail/samsung-electro-mechanics/CL10A106MQ8NNNC/3886777; Supplier 1: Digi-Key; Supplier Part Number 1: 1276-1119-1-ND; Tolerance: +/- 20%; Voltage: 6.3V
R1 R2 R18 R23 = RESISTOR_100K_0402: as R65 on sheet Connectors; Wattage: 1/16W; Supplier 1: Digikey; Supplier Part Number 1: YAG3434CT-ND
R3 R30 R55 R56 = CMP-2002-06400-1: Manufacturer: Yageo; Part Number: RL0402JR-070R1L
R4-R7 R10-R12 R15 R20 R21 R25 R26 R28 R57 R59 R60 = RESISTOR_1M_0402: RES 1M OHM 1% 1/16W 0402; Tolerance: +/- 1%; Made By: Robert Pafford; Wattage: 1/16W; Supplier 1: Digikey; Supplier Part Number 1: YAG3450CT-ND
R8 R9 R22 R27 = RESISTOR_10K_0402: as R29 on sheet Connectors; Wattage: 1/16W; Supplier: Digikey; Digikey Part Numer: CR0603-JW-104ELFTR-ND; Supplier 1: Digi-Key; Supplier Part Number 1: YAG3436CT-ND
R16 R17 R32 R33 R39 R40 R43-R54 R58 R61 = RESISTOR_0_0402: RES 0 OHM 1% 1/16W 0402; Tolerance: +/- 1%; Made By: Robert Pafford; Wattage: 1/16W; Supplier 1: Digikey; Supplier Part Number 1: 13-AC0402FR-070RLCT-ND
R31 R34-R38 R41 R42 = CMP-26527-005040-1: 10Ω ±1% 0.1W 0603 Thick Film Chip Resistor AEC-Q200 compliant; Max Power Dissipation: 100mW; Temperature Coefficient: 100ppm/°C; Radiation Hardening: No; Military Standard: Not; Resistor Type: Thick Film; Case/Package: 0603; Case Code (Metric): 1608; Power Rating: 100mW; Min Operating Temperature: -55°C; Mount: Surface Mount; Width: 0.031inch; Packaging: Tape and Reel; Tolerance: 1%; Case Code (Imperial): 0603; Number of Terminations: 2; Height: 0.022inch; Features: Automotive AEC-Q200; Construction: Rectangular; Contact Plating: Tin; RoHS Compliant: Yes; Length: 1.55mm; Max Operating Temperature: 155°C; Depth: 0.8mm; Series: RMCF
TP3-TP6 = TESTPOINT: Made By: Robert Pafford
U1-U4 = CMP-0018-00600-2: 250 MHz, Rail-to-Rail I/O, CMOS Dual Operational Amplifier, 2.7 to 5.5 V, -40 to 125 degC, 8-pin SOP (DGK8), Green (RoHS & no Sb/Br); Manufacturer: Texas Instruments; Slew Rate(Typ)(V/us): 150; Acl, min stable gain(V/V): 1; 3rd Harmonic(dBc): 83; Iq per channel(Max)(mA): 7.5; Vs(Max)(V): 5.5; Vn at Flatband(Typ)(nV/rtHz): 6.5; Vio(Max)(mV): 8; Rail-Rail: In, Out; BW @ Acl(MHz): 250; THD (Fc is 1 MHz)(Typ)(dB): -73; Io(Typ)(mA): 100; Iib(Max)(nA): 0.05; Number of Channels: 2; Settling Time (0.1%)(Typ)(ns): 30; 2nd Harmonic(dBc): 75; Sub Family: High Output Current Amplifier (>=50mA), High Speed Amplifier (>=50MHz), Low Supply Voltage Amplifier (<=2.7V); Diff Phase(deg): 0.09; Vs(Min)(V): 2.7; Diff Gain(%): 0.02; Eco-Plan: Green (RoHS & no Sb/Br); ComponentLink3Description: Package Specification; PackageDescription: 8-Pin Thin Small Outline, Body 3 x 3 mm, Pitch 0.65 mm; Mounting Technology: Surface Mount; @ MHz: 1; Code_JEDEC: MO-187; PackageVersion: 4073329/E, 05/2006; ComponentLink1Description: Manufacturer URL; PartNumber: OPA2354AIDGKR; PackageReference: DGK0008A; ComponentLink2Description: Datasheet; ComponentLink1URL: http://www.ti.com/; DatasheetVersion: SBOS233E; ComponentLink3URL: http://www.ti.com/litv/pdf/mpds028d; ComponentLink2URL: http://www.ti.com/general/docs/lit/getliterature.tsp?genericPartNumber=OPA2354&fileType=pdf
U6 U7 = ADS7253IRTET: 12 Bit, 1 MSPS, Dual, Simultaneous Sampling Single Ended / Pseudo-Differential SAR ADC 16-WQFN -40 to 125; Manufacturer: TI; Max Sampling: 1 MSpS; Supplier 1: DigiKey; Supplier Part Number 1: 296-38482-1-ND; Created By: John Ulm

## Nets that join several sheets
3V3: Connectors (C19.1 J12.4 U5.5), Filters (C27.2 C29.2 U6.7 U7.7)
+2.5: Connectors (C36.1 SB1.1 TP2.TP U9.2), Filters (R16.2 R17.2 R58.2 R61.2)
+5: Connectors (14 pins), Filters (22 pins)
GND: Connectors (32 pins), Filters (44 pins)
Audio_CH1: Connectors (J8.1 R13.1), Filters (C5.2)
Audio_CH2: Connectors (J9.1 R14.1), Filters (C7.2)
Audio_CH3: Connectors (J10.1 R19.1), Filters (C15.2)
Audio_CH4: Connectors (J11.1 R24.1), Filters (C13.2)
CH1_SDO: Connectors (J1.3), Filters (R39.1)
CH2_SDO: Connectors (J1.5), Filters (R43.1)
CH3_SDO: Connectors (J1.15), Filters (R44.1)
CH4_SDO: Connectors (J1.13), Filters (R40.1)
CLK: Connectors (J1.7), Filters (R47.1 R48.1)
CS_1: Connectors (J1.9), Filters (R49.1)
CS_2: Connectors (J1.16), Filters (R50.1)
SDI_1: Connectors (J1.11), Filters (R45.2)
SDI_2: Connectors (J1.14), Filters (R46.2)

## Assembly variants
5V LDO: not fitted C35 C36 C37 C38 L1 R13 R14 R19 R24 R62 R63 R65 U9 U10
5V Switching: not fitted C31 C32 C33 C34 R13 R14 R19 R24 R62 R63 SB1 SB2 U8